# Altium schematic sheet LCDTFTPWR_AP3031.SchDoc
size A3
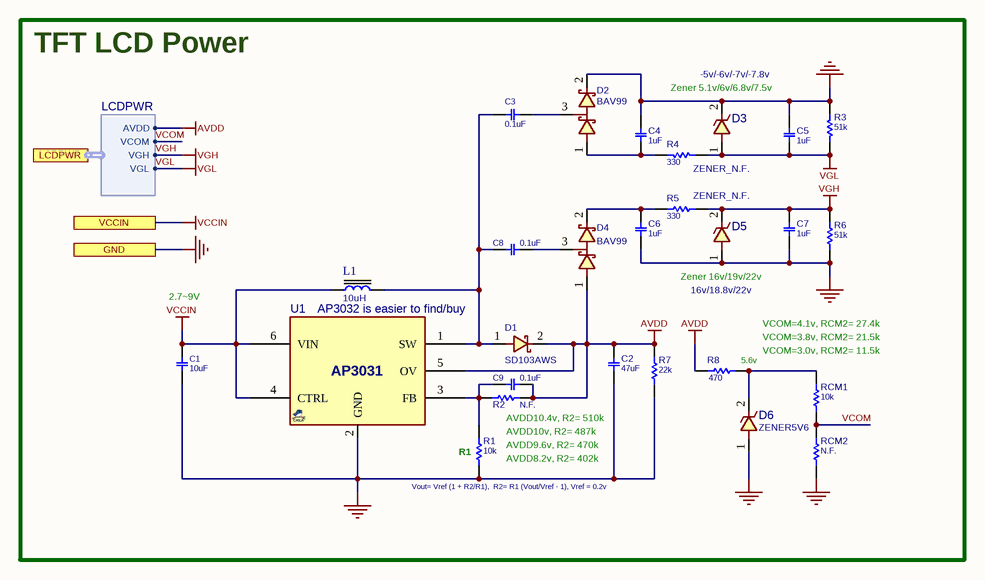
[diagram p0: LCDTFTPWR_AP3031.SchDoc]

## Parts
C1  10uF  [C0402]
C2  47uF  [C1206]
C3  0.1uF  [C0402]
C4  1uF  [C0603]
C5  1uF  [C0603]
C6  1uF  [C0603]
C7  1uF  [C0603]
C8  0.1uF  [C0402]
C9  0.1uF  [C0402]
D1  SD103AWS  [D_SOD323]
D2  BAV99  [SOT23_3]
D3  ZENER_N.F.  [D_SOD123W]
D4  BAV99  [SOT23_3]
D5  ZENER_N.F.  [D_SOD123W]
D6  ZENER5V6  [D_SOD123W]
L1  10uH  [L_4]
R1  10k  [R0402]
R2  N.F.  [R0402]
R3  51k  [R0402]
R4  330  [R0402]
R5  330  [R0402]
R6  51k  [R0402]
R7  22k  [R0402]
R8  470  [R0402]
RCM1  10k  [R0402]
RCM2  N.F.  [R0402]
U1  AP3031  [SOT23_6]  (value not drawn)

## Ports
GND, LCDPWR (harness LCDPWR), VCCIN

## Harnesses
LCDPWR: AVDD, VGH, VCOM, VGL

## Nets
AVDD: C2.2 C9.1 D1.2 D4.1 R2.2 R7.1 R8.1 U1.5(OV) ; port LCDPWR.AVDD
GND: C1.1 C2.1 C4.1 C5.1 C6.1 C7.1 D2.2 D3.2 D5.1 D6.1 R1.2 R3.1 R6.1 R7.2 RCM2.2 U1.2(GND) ; port GND
VCCIN: C1.2 L1.1 U1.4(CTRL) U1.6(VIN) ; port VCCIN
VGH: C7.2 D5.2 R5.2 R6.2 ; port LCDPWR.VGH
VGL: C5.2 D3.1 R3.2 R4.2 ; port LCDPWR.VGL
VCOM: RCM1.2 RCM2.1 ; port LCDPWR.VCOM
NetC3_1: C3.1 D2.3
NetC3_2: C3.2 C8.2 D1.1 L1.2 U1.1(SW)
NetC4_2: C4.2 D2.1 R4.1
NetC6_2: C6.2 D4.2 R5.1
NetC8_1: C8.1 D4.3
NetC9_2: C9.2 R1.1 R2.1 U1.3(FB)
NetD6_2: D6.2 R8.2 RCM1.1

## Notes on the sheet
- TFT LCD Power
- (near D3) Zener 5.1v/6v/6.8v/7.5v
- -5v/-6v/-7v/-7.8v
- 2.7~9V
- (near L1) AP3032 is easier to find/buy
- (near D5) Zener 16v/19v/22v
- (near D5) 16v/18.8v/22v
- (near R8) 5.6v
- VCOM=4.1v, RCM2= 27.4k
- VCOM=3.8v, RCM2= 21.5k
- VCOM=3.0v, RCM2= 11.5k
- (near R1) R1
- (near R2) AVDD10.4v, R2= 510k
- AVDD10v, R2= 487k
- AVDD9.6v, R2= 470k
- (near R1) Vout= Vref (1 + R2/R1),  R2= R1 (Vout/Vref - 1), Vref = 0.2v
- (near R1) AVDD8.2v, R2= 402k

## Library data of the parts
C1 = CAP_SMD_MLCC: CAP, MLCC; PARAM: X5R, 10%; MANF_P#: CL10A106MO8NQNC; MANF: Samsung; PARAM2: 16v; PRICE: 5000:	$0.01; ASSEMBLY: ASSEMBLY; VALUE: 10uF
C2 = CAP_SMD_MLCC: CAP, MLCC; PARAM: X5R, 10%; MANF_P#: GRM31CR61E476ME44L; MANF: Murata; PARAM2: 25v; PRICE: 100:	$0.27; ASSEMBLY: ASSEMBLY; VALUE: 47uF
C3 C8 C9 = CAP_SMD_MLCC_100n50V: CAP, MLCC, 100nF, 50V, X7R, 10%, 0402C; MANF: Murata; MANF_P#: GCM155R71H104KE02D; PARAM: 50V; DESC: CAP, MLCC, 100nF, 50V, X7R, 10%, 0402C; PARAM2: X7R, 10%; ASSEMBLY: ASSEMBLY; PRICE: 100= 1.3$; VALUE: 0.1uF
C4-C7 = CAP_SMD_MLCC: CAP, MLCC; PARAM: X5R, 10%; MANF_P#: CL10A105KB8NNNC; MANF: Samsung; PARAM2: 50v; PRICE: 50,000:	$0.006; ASSEMBLY: ASSEMBLY; VALUE: 1uF
D1 = DIODE_SMD_SCHOTTKY_1N5819: DIODE, SCHOTTKY, 40V, 2A; MANF: DIODES; DESC: DESCRIPTION; MANF_P#: SD103AWS; ASSEMBLY: ASSEMBLY; PRICE: PRICE; PARAM2: 2A; PARAM: 40V; VALUE: SD103AWS
D2 D4 = DIODE_SMD_SCHOTTKY_BAV99: DIODE, SCHOTTKY, DUAL, 30V, 0.2A; MANF: Diodes; DESC: DESCRIPTION; PARAM: 30V/200MW; MANF_P#: BAV99; ASSEMBLY: ASSEMBLY; PRICE: PRICE; PARAM2: 0.2A; VALUE: BAV99
D3 D5 D6 = DIODE_SMD_ZENER_DFLZ5V1: DIODE, ZENER, 0.5W; MANF: Diodes; DESC: DESCRIPTION; PARAM: 0.5W, -55~150oC; ASSEMBLY: ASSEMBLY; PRICE: 0.5$; PARAM2: -; MANF_P#: -
  D3 D5: VALUE: ZENER_N.F.
  D6: VALUE: ZENER5V6
L1 = INDPWR_SMD: INDUCTOR, POWER, SMD; MANF_P#: GCD43-100MC; VALUE: 10uH
R1-R8 RCM1 RCM2 = RES_SMD: RESISTOR, SMD, 20K, 0402; MANF: Yageo; PARAM: 0.063W; DIST#: MOUSER; PARAM2: 1%; MANF_P#: RK73H1ETTP2002F; ASSEMBLY: ASSEMBLY; PRICE: 100= 0.5$; DESC: RESISTOR, SMD, 20K, 0402
  R1 RCM1: VALUE: 10k
  R2 RCM2: VALUE: N.F.
  R3 R6: VALUE: 51k
  R4 R5: VALUE: 330
  R7: VALUE: 22k
  R8: VALUE: 470
U1 = VREG_AP3031_SOT23: REG, Switching, Boost, 1.4A, ADJ, 1MHz, SOT-23-6; PARAM: 1.4A, 1MHz, -40~85oC; PARAM2: 2.7~16VIN; MANF_P#: AP3031K; MANF: Diodes; PRICE: 0.1$; VALUE: AP3031